# EAGLE design gpio_adapter (EAGLE 7.3.0)
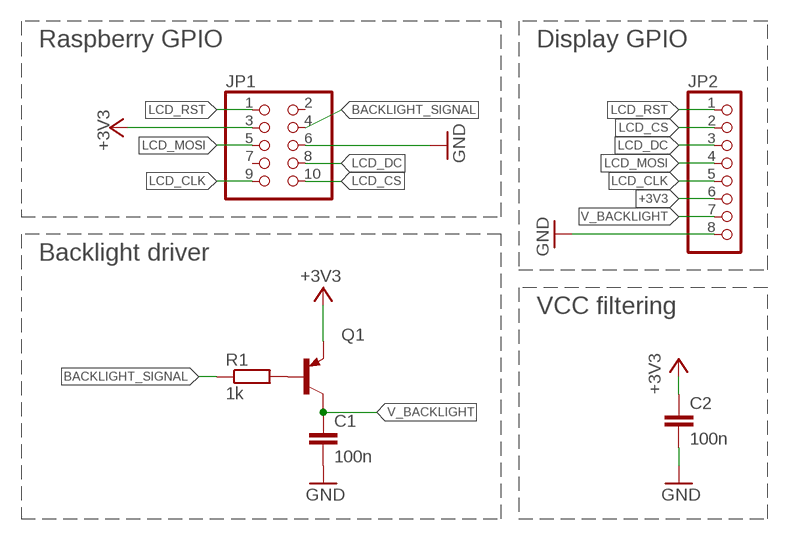
[diagram p0: schematic, sheet 1]

## Parts
C1  100n  C-EUC0805  [C0805]
C2  100n  C-EUC0805  [C0805]
JP1  PINHD-2X5  [2X05]
JP2  PINHD-1X8/90  [1X08/90]
Q1  BC807-40SMD  [SOT23-BEC]
R1  1k  R-EU_R0805  [R0805]

## Nets
+3V3: C2.1 JP1.3 JP2.6 Q1.E
BACKLIGHT_SIGNAL: JP1.4 R1.1
GND: C1.2 C2.2 JP1.6 JP2.8
LCD_CLK: JP1.9 JP2.5
LCD_CS: JP1.10 JP2.2
LCD_DC: JP1.8 JP2.3
LCD_MOSI: JP1.5 JP2.4
LCD_RST: JP1.1 JP2.1
N$2: Q1.B R1.2
V_BACKLIGHT: C1.1 JP2.7 Q1.C
Unconnected: JP1.2 JP1.7

## Notes on the sheet
- Raspberry GPIO | Display GPIO
- Backlight driver
- VCC filtering

## Library data of the parts
C1 C2 = rcl:C-EU: CAPACITOR, European symbol
JP1 = pinhead:PINHD-2X5: PIN HEADER
JP2 = pinhead:PINHD-1X8: PIN HEADER
Q1 = transistor-pnp:BC807*: PNP Transistror
R1 = rcl:R-EU_: RESISTOR, European symbol

## Board
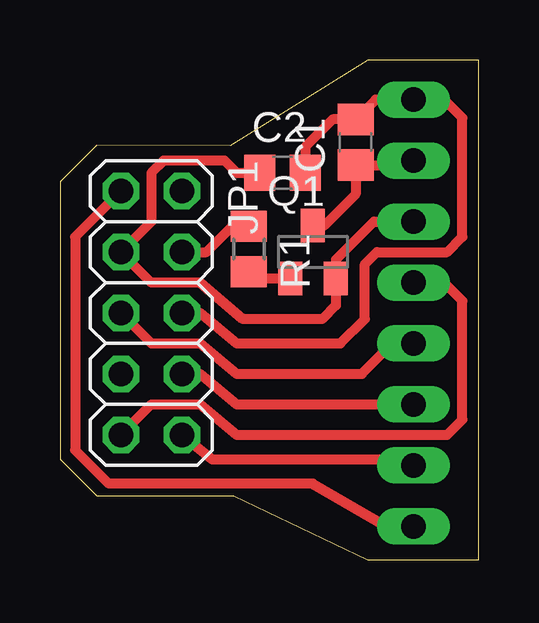
[diagram p1: board, top side]
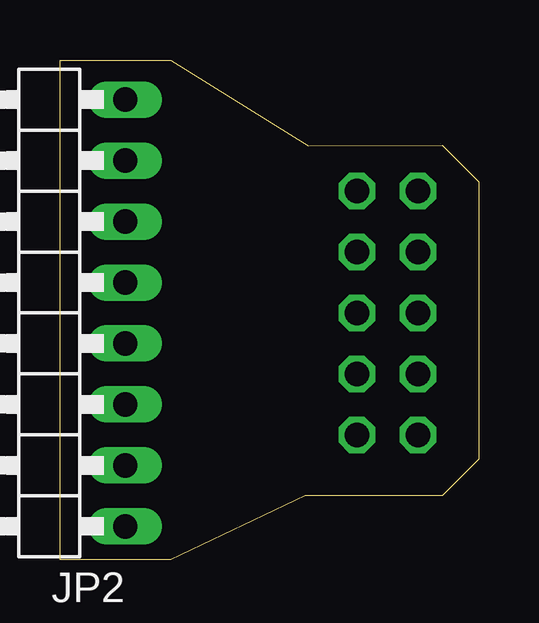
[diagram p2: board, bottom side, seen from below]

Size 17.45 x 20.83 mm. Coordinates in mm from the lower left corner, seen from the top.
Outline: 0,4.19 1.52,2.67 7.24,2.67 12.83,0 17.45,0 17.45,20.82 12.83,20.83 7.1,17.26 1.52,17.27 0,15.75 0,4.19
Copper layers (1*16): Top 0.035mm / dielectric 1.5mm / Bottom 0.035mm
Design rules "default": minimum track width 10mil, minimum drill 24mil, track to track 8mil, track to pad 8mil, pad to pad 8mil, via to via 8mil, smd to smd 8mil, copper to edge 40mil, drill to drill 8mil, minimum pad ring 10mil, minimum via ring 8mil, stop-mask expansion 4mil, vias tented up to drill 0mil, thermal gap 10mil

### Footprints (pad centres in the part's own frame; a part is rotated, then mirrored left to right if it is on the bottom)
C0805 = smd 1.3 x 1.5: 1 -0.95,0; 2 0.95,0
2X05 = drill 1.016 octagon: 1 -5.08,-1.27; 2 -5.08,1.27; 3 -2.54,-1.27; 4 -2.54,1.27; 5 0,-1.27; 6 0,1.27; 7 2.54,-1.27; 8 2.54,1.27; 9 5.08,-1.27; 10 5.08,1.27
1X08/90 = drill 1.016 long: 1 -8.89,-3.81; 2 -6.35,-3.81; 3 -3.81,-3.81; 4 -1.27,-3.81; 5 1.27,-3.81; 6 3.81,-3.81; 7 6.35,-3.81; 8 8.89,-3.81
SOT23-BEC = smd 1 x 1.4: B -0.95,-1.1; C 0,1.1; E 0.95,-1.1
R0805 = smd 1.3 x 1.5: 1 -0.95,0; 2 0.95,0

### Placement (x,y rotation side)
C1  12.32,17.4 90 top
C2  9.27,16.13 0 top
JP1  3.81,10.29 270 top
JP2  18.54,10.29 90 bottom
Q1  10.54,12.83 0 top
R1  7.87,12.95 270 top

### Tracks (layer width: path | path; a pad name or v marks a point on that pad's centre or on a via)
+3V3
  Top 0.406: JP2.6 13.08,14.1 11.49,12.51 Q1.E 11.49,10.6 10.92,10.03 7.62,10.03 5.84,11.56 3.81,11.56 JP1.3 3.81,14.1 3.81,16.13 4.32,16.64 6.86,16.64 7.37,16.13 C2.1
BACKLIGHT_SIGNAL
  Top 0.406: JP1.4 6.1,12.83 7.17,13.9 R1.1
GND
  Top 0.406: JP1.6 5.84,10.29 7.37,9.02 11.68,9.02 12.7,10.03 12.7,12.32 13.21,12.83 16.13,12.83 16.76,13.46 16.76,18.41 16,19.18 JP2.8 13.15,19.18 C1.2 11.36,18.35 10.22,17.21 C2.2
LCD_CLK
  Top 0.406: JP1.9 3.81,6.48 5.84,6.48 7.37,5.21 16.13,5.21 16.76,5.84 16.76,10.79 16,11.56 JP2.5
LCD_CS
  Top 0.406: JP1.10 6.35,4.19 14.48,4.19 JP2.2
LCD_DC
  Top 0.406: JP1.8 5.84,7.75 7.37,6.48 JP2.3
LCD_MOSI
  Top 0.406: JP1.5 3.81,9.02 5.84,9.02 7.37,7.75 12.57,7.75 13.84,9.02 JP2.4
LCD_RST
  Top 0.406: JP2.1 13.59,1.4 10.54,3.17 2.03,3.17 0.64,4.57 0.64,13.46 JP1.1
N$2
  Top 0.406: R1.2 8.15,11.73 Q1.B
V_BACKLIGHT
  Top 0.406: JP2.7 14.1,16.64 13.66,16.45 C1.1 12.32,15.24 11.01,13.93 Q1.C